# EAGLE design pcb_bottom (EAGLE 9.6.2)
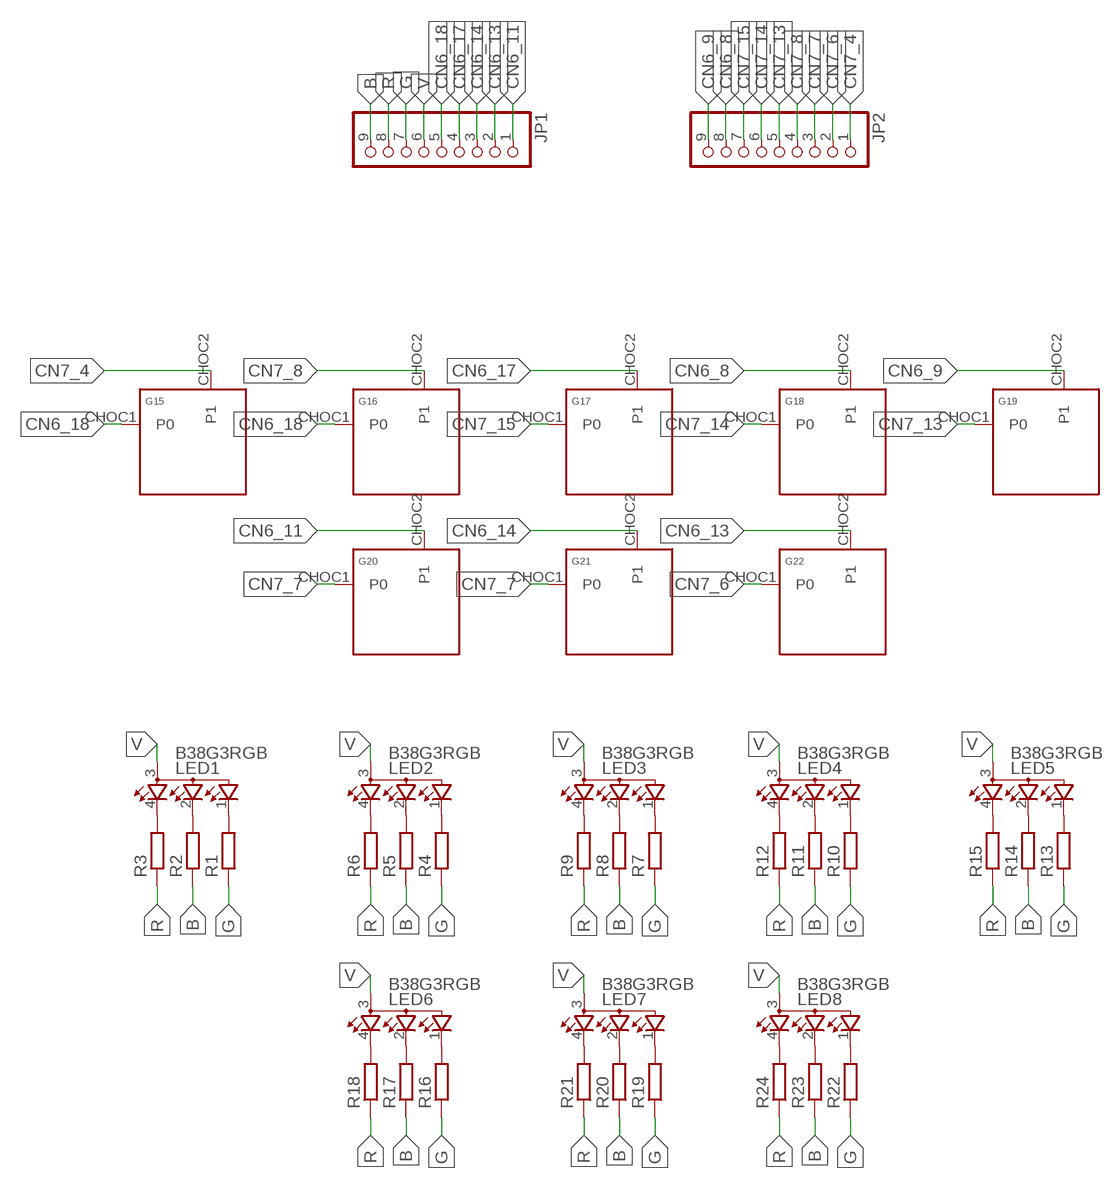
[diagram p0: schematic, sheet 1]

## Parts
G15  KEYSWITCH-PLAIN-CHOC-1U  [CHOC-1U]
G16  KEYSWITCH-PLAIN-CHOC-1U  [CHOC-1U]
G17  KEYSWITCH-PLAIN-CHOC-1U  [CHOC-1U]
G18  KEYSWITCH-PLAIN-CHOC-1U  [CHOC-1U]
G19  KEYSWITCH-PLAIN-CHOC-1U  [CHOC-1U]
G20  KEYSWITCH-PLAIN-CHOC-1U  [CHOC-1U]
G21  KEYSWITCH-PLAIN-CHOC-1U  [CHOC-1U]
G22  KEYSWITCH-PLAIN-CHOC-1U  [CHOC-1U]
JP1  THROUHOLE09  [THROUHOLE09]
JP2  THROUHOLE09  [THROUHOLE09]
LED1  B38G3RGB  [B38G3RGB]
LED2  B38G3RGB  [B38G3RGB]
LED3  B38G3RGB  [B38G3RGB]
LED4  B38G3RGB  [B38G3RGB]
LED5  B38G3RGB  [B38G3RGB]
LED6  B38G3RGB  [B38G3RGB]
LED7  B38G3RGB  [B38G3RGB]
LED8  B38G3RGB  [B38G3RGB]
R1  R-EU_R0603  [R0603]
R2  R-EU_R0603  [R0603]
R3  R-EU_R0603  [R0603]
R4  R-EU_R0603  [R0603]
R5  R-EU_R0603  [R0603]
R6  R-EU_R0603  [R0603]
R7  R-EU_R0603  [R0603]
R8  R-EU_R0603  [R0603]
R9  R-EU_R0603  [R0603]
R10  R-EU_R0603  [R0603]
R11  R-EU_R0603  [R0603]
R12  R-EU_R0603  [R0603]
R13  R-EU_R0603  [R0603]
R14  R-EU_R0603  [R0603]
R15  R-EU_R0603  [R0603]
R16  R-EU_R0603  [R0603]
R17  R-EU_R0603  [R0603]
R18  R-EU_R0603  [R0603]
R19  R-EU_R0603  [R0603]
R20  R-EU_R0603  [R0603]
R21  R-EU_R0603  [R0603]
R22  R-EU_R0603  [R0603]
R23  R-EU_R0603  [R0603]
R24  R-EU_R0603  [R0603]

## Nets
B: JP1.9 R2.1 R5.1 R8.1 R11.1 R14.1 R17.1 R20.1 R23.1
CN6_8: G18.CHOC2(P1) JP2.8
CN6_9: G19.CHOC2(P1) JP2.9
CN6_11: G20.CHOC2(P1) JP1.1
CN6_13: G22.CHOC2(P1) JP1.2
CN6_14: G21.CHOC2(P1) JP1.3
CN6_17: G17.CHOC2(P1) JP1.4
CN6_18: G15.CHOC1(P0) G16.CHOC1(P0) JP1.5
CN7_4: G15.CHOC2(P1) JP2.1
CN7_6: G22.CHOC1(P0) JP2.2
CN7_7: G20.CHOC1(P0) G21.CHOC1(P0) JP2.3
CN7_8: G16.CHOC2(P1) JP2.4
CN7_13: G19.CHOC1(P0) JP2.5
CN7_14: G18.CHOC1(P0) JP2.6
CN7_15: G17.CHOC1(P0) JP2.7
G: JP1.7 R1.1 R4.1 R7.1 R10.1 R13.1 R16.1 R19.1 R22.1
N$1: LED1.1(CGREEN) R1.2
N$2: LED1.2(CBLUE) R2.2
N$3: LED1.4(CRED) R3.2
N$4: LED2.1(CGREEN) R4.2
N$5: LED2.2(CBLUE) R5.2
N$6: LED2.4(CRED) R6.2
N$7: LED3.1(CGREEN) R7.2
N$8: LED3.2(CBLUE) R8.2
N$9: LED3.4(CRED) R9.2
N$10: LED4.1(CGREEN) R10.2
N$11: LED4.2(CBLUE) R11.2
N$12: LED4.4(CRED) R12.2
N$13: LED5.1(CGREEN) R13.2
N$14: LED5.2(CBLUE) R14.2
N$15: LED5.4(CRED) R15.2
N$16: LED6.1(CGREEN) R16.2
N$17: LED6.2(CBLUE) R17.2
N$18: LED6.4(CRED) R18.2
N$19: LED7.1(CGREEN) R19.2
N$20: LED7.2(CBLUE) R20.2
N$21: LED7.4(CRED) R21.2
N$22: LED8.1(CGREEN) R22.2
N$23: LED8.2(CBLUE) R23.2
N$24: LED8.4(CRED) R24.2
R: JP1.8 R3.1 R6.1 R9.1 R12.1 R15.1 R18.1 R21.1 R24.1
V: JP1.6 LED1.3(A) LED2.3(A) LED3.3(A) LED4.3(A) LED5.3(A) LED6.3(A) LED7.3(A) LED8.3(A)

## Library data of the parts
G15-G22 = Keyboard:KEYSWITCH-PLAIN
JP1 JP2 = pinhead-half-pitch:THROUHOLE09
LED1-LED8 = led_rgb:B38G3RGB: Chip LED RGB Source: http://document.sharpsma.com/files/GM1WA55311A_SS.pdf
R1-R24 = rcl:R-EU_: RESISTOR, European symbol; SPICEPREFIX: R

## Board
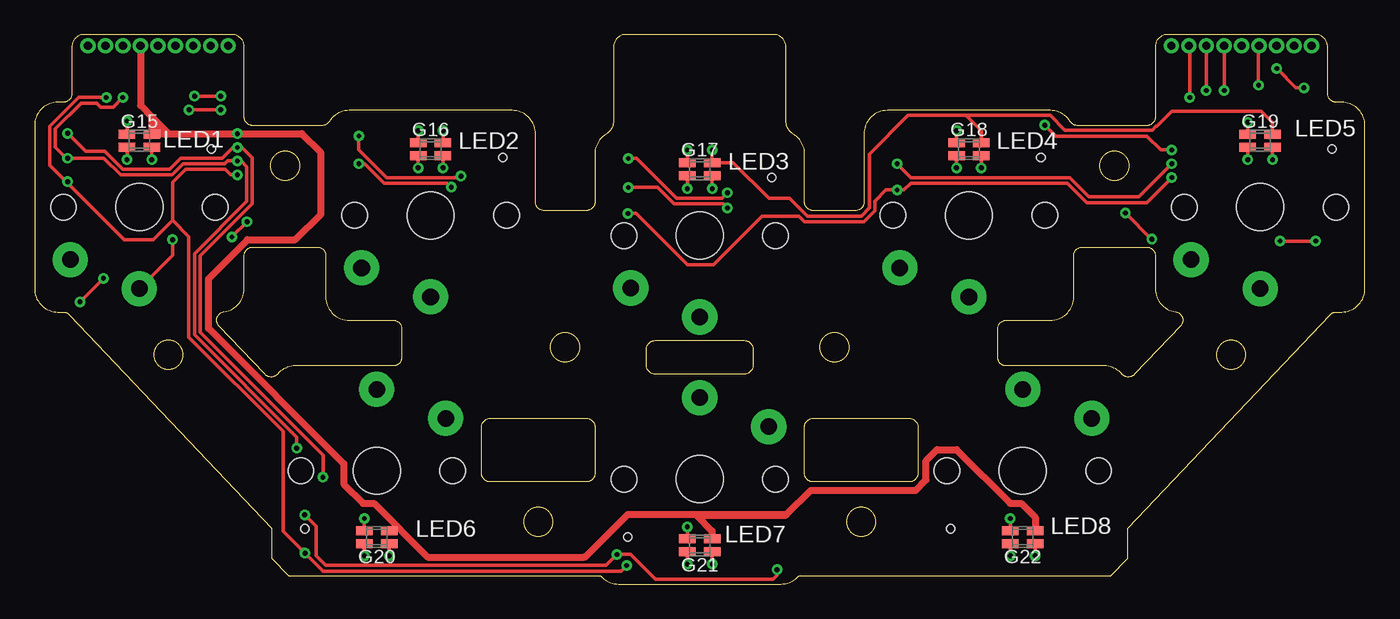
[diagram p1: board, top side]
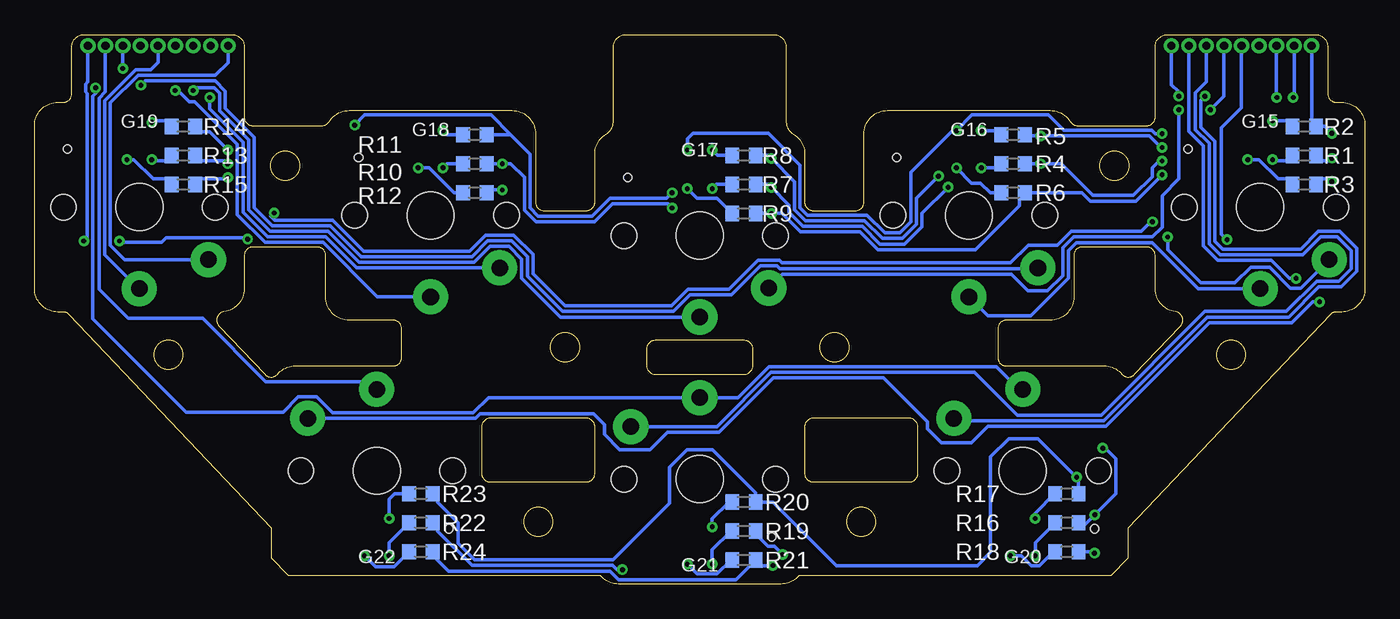
[diagram p2: board, bottom side, seen from below]

Size 96.4 x 39.8 mm. Coordinates in mm from the lower left corner, seen from the top.
Outline: 15.8,24.4 20.5,24.4 arc-90 21.1,23.8 21.1,20.8 arc90 22.8,19.1 26,19.1 arc-90 26.6,18.5 26.6,16.4 arc-90 26,15.8 18.9,15.8 arc50 17.6,15.2 arc-96 16.71,15.18 13.36,18.71 arc-126 13.72,19.71 arc83 15.2,21.4 15.2,23.8 arc-90 15.8,24.4
Outline: 75.3,20.8 75.3,23.8 arc-90 75.9,24.4 80.6,24.4 arc-90 81.2,23.8 81.2,21.4 arc83 82.68,19.71 arc-126 83.04,18.71 79.69,15.18 arc-96 78.8,15.2 arc50 77.5,15.8 70.4,15.8 arc-90 69.8,16.4 69.8,18.5 arc-90 70.4,19.1 73.6,19.1 arc90 75.3,20.8
Outline: 32.4,11.4 arc-90 33,12 40,12 arc-90 40.6,11.4 40.6,8 arc-90 40,7.4 33,7.4 arc-90 32.4,8 32.4,11.4
Outline: 55.8,11.4 arc-90 56.4,12 63.4,12 arc-90 64,11.4 64,8 arc-90 63.4,7.4 56.4,7.4 arc-90 55.8,8 55.8,11.4
Outline: 52.05,15.8 arc-90 51.45,15.2 44.95,15.2 arc-90 44.35,15.8 44.35,17.04 arc-90 44.95,17.64 51.45,17.64 arc-90 52.05,17.04 52.05,15.8
Outline: 80.6,33.2 75.56,33.2 arc-59 75.05,33.49 arc59 73.6,34.3 61.8,34.3 arc90 60.1,32.6 60.1,27.65 arc-90 59.5,27.05 56.4,27.05 arc-90 55.8,27.65 55.8,31.14 arc59 54.98,32.59 arc-59 54.45,33.53 54.45,38.9 arc90 53.55,39.8 42.85,39.8 arc90 41.95,38.9 41.95,33.53 arc-59 41.42,32.59 arc59 40.6,31.14 40.6,27.65 arc-90 40,27.05 36.9,27.05 arc-90 36.3,27.65 36.3,32.6 arc90 34.6,34.3 22.8,34.3 arc59 21.35,33.49 arc-59 20.84,33.2 15.8,33.2 arc-90 15.2,33.8 15.2,38.9 arc90 14.3,39.8 3.6,39.8 arc90 2.7,38.9 2.7,35.5 arc-90 2.1,34.9 1.7,34.9 arc90 0,33.2 0,21.4 arc90 1.7,19.7 2.1,19.7 arc-46 2.53,19.51 17.2,4.06 17.2,1.88 18.41,0.6 41,0.6 arc50 42.3,0 54.1,0 arc50 55.4,0.6 77.99,0.6 79.2,1.88 79.2,4.06 93.87,19.51 arc-46 94.3,19.7 94.7,19.7 arc90 96.4,21.4 96.4,33.2 arc90 94.7,34.9 94.3,34.9 arc-90 93.7,35.5 93.7,38.9 arc90 92.8,39.8 82.1,39.8 arc90 81.2,38.9 81.2,33.8 arc-90 80.6,33.2
Outline: circle at 18.15,30.3 radius 1.05
Outline: circle at 9.71,16.6 radius 1.05
Outline: circle at 36.5,4.5 radius 1.05
Outline: circle at 38.45,17.15 radius 1.05
Outline: circle at 57.95,17.15 radius 1.05
Outline: circle at 59.9,4.5 radius 1.05
Outline: circle at 86.69,16.6 radius 1.05
Outline: circle at 78.25,30.3 radius 1.05
Copper layers (1*16): Top 0.035mm / dielectric 1.5mm / Bottom 0.035mm
Design rules "PCBGoGo": minimum track width 6mil, minimum drill 0.2mm, track to track 6mil, track to pad 6mil, pad to pad 6mil, via to via 6mil, smd to smd 6mil, copper to edge 0.2mm, drill to drill 6mil, minimum pad ring 10mil, minimum via ring 8mil, stop-mask expansion 4mil, vias tented up to drill 0mil, thermal gap 10mil

### Footprints (pad centres in the part's own frame; a part is rotated, then mirrored left to right if it is on the bottom)
CHOC-1U = drill 1.2 pad 2.54: CHOC1 0,5.9; CHOC2 5,3.8 | hole 3.4: 0,0 | hole 0.6: -5.22,-4.2 | hole 1.85: -5.5,0; 5.5,0
THROUHOLE09 = drill 0.6: 1 -5.08,0; 2 -3.81,0; 3 -2.54,0; 4 -1.27,0; 5 0,0; 6 1.27,0; 7 2.54,0; 8 3.81,0; 9 5.08,0
B38G3RGB = smd 0.65 x 1.2: 1 -0.475,0.9; 2 0.475,0.9; 3 0.475,-0.9; 4 -0.475,-0.9
R0603 = smd 1 x 1.1: 1 -0.85,0; 2 0.85,0

### Placement (x,y rotation side)
G15  7.6,27.3 180 top
G16  28.7,26.7 180 top
G17  48.2,25.24 180 top
G18  67.7,26.7 180 top
G19  88.8,27.3 180 top
G20  24.8,8.2 0 top
G21  48.2,7.6 0 top
G22  71.6,8.2 0 top
JP1  8.95,38.99 180 top
JP2  87.45,38.99 180 top
LED1  7.6,32.1 90 top
LED2  28.7,31.5 90 top
LED3  48.2,30.04 90 top
LED4  67.7,31.5 90 top
LED5  88.8,32.1 90 top
LED6  24.8,3.4 90 top
LED7  48.2,2.8 90 top
LED8  71.6,3.4 90 top
R1  4.4,31.04 180 bottom
R2  4.4,33.14 180 bottom
R3  4.4,28.94 180 bottom
R4  25.5,30.44 180 bottom
R5  25.5,32.54 180 bottom
R6  25.5,28.34 180 bottom
R7  45,28.94 180 bottom
R8  45,31.04 180 bottom
R9  45,26.84 180 bottom
R10  64.5,30.44 180 bottom
R11  64.5,32.54 180 bottom
R12  64.5,28.34 180 bottom
R13  85.6,31.04 180 bottom
R14  85.6,33.14 180 bottom
R15  85.6,28.94 180 bottom
R16  21.6,4.44 180 bottom
R17  21.6,6.54 180 bottom
R18  21.6,2.34 180 bottom
R19  45,3.84 180 bottom
R20  45,5.94 180 bottom
R21  45,1.74 180 bottom
R22  68.4,4.44 180 bottom
R23  68.4,6.54 180 bottom
R24  68.4,2.34 180 bottom

### Tracks (layer width: path | path; a pad name or v marks a point on that pad's centre or on a via)
B  (via drill 0.35)
  Top 0.254: v2.4,32.64 3.7,31.34 5.1,31.34 6.4,30.04 9.8,30.04 10.6,30.84 13.6,30.84 14.38,31.62 v14.7,31.62 14.72,31.64 15,31.64 15.77,30.87 15.77,27.54 12,23.77 12,18.24 20.9,9.34 v20.9,7.74 | v23.5,32.45 23.5,31.44 25.5,29.44 30.8,29.44 v30.9,29.54 | v43.02,30.82 43.62,30.82 46.5,27.94 49.8,27.94 v50.2,28.34 | v82.4,31.44 81.6,31.44 80.6,32.44 74,32.44 v73.2,33.24
  Bottom 0.254: JP1.9 3.87,33.46 R2.1 2.9,33.14 v2.4,32.64 | v14.7,31.62 14.8,31.62 15.63,32.45 v23.5,32.45 24.57,32.45 R5.1 | v30.9,29.54 32.49,27.95 32.49,26.06 33.52,25.03 34.97,25.03 36.25,26.32 40.56,26.32 41.33,27.09 41.33,29.14 v43.02,30.82 43.23,31.04 R8.1 | v50.2,28.34 50.6,27.94 54.7,27.94 56,26.64 59.9,26.64 60.5,27.24 60.5,31.14 61.9,32.54 | 61.9,32.54 R11.1 | R14.1 84.35,32.74 83.7,32.74 v82.4,31.44 | v73.2,33.24 72.47,33.97 63.33,33.97 61.9,32.54 | R17.1 20.75,7.59 v20.9,7.74 23.7,10.54 25.8,10.54 27.13,9.21 27.13,2.3 28.09,1.34 38.3,1.34 42.9,5.94 R20.1 44.15,6.62 47.26,9.73 49.14,9.73 50.4,8.47 50.4,5.85 54.5,1.75 64.51,1.75 65.7,2.94 65.7,4.44 67.2,5.94 67.2,6.19 R23.1
CN6_8  (via drill 0.35)
  Top 0.254: v83.7,35.24 83.7,38.93 JP2.8
  Bottom 0.254: G18.CHOC2 73.06,22.9 75.31,25.15 79.51,25.15 81.29,26.93 81.29,32.01 83.7,34.41 v83.7,35.24
CN6_9
  Bottom 0.254: G19.CHOC2 89.85,23.5 90.9,24.55 90.9,34.84 88.9,36.84 83.3,36.84 82.37,37.77 JP2.9
CN6_11  (via drill 0.35)
  Top 0.254: v11.6,35.34 v13.5,35.34
  Bottom 0.254: G20.CHOC2 29.63,11.83 18.93,11.83 11.43,19.33 5.53,19.33 3.33,21.53 1.73,21.53 0.59,22.67 0.59,24.31 1.83,25.55 3.37,25.55 4.67,24.25 10.31,24.25 10.89,24.82 10.89,32.08 11.88,33.07 11.88,35.06 v11.6,35.34 | v13.5,35.34 13.5,35.64 14.03,36.17 JP1.1
CN6_13  (via drill 0.35)
  Top 0.254: v5,22.14 v3.3,20.44
  Bottom 0.254: G22.CHOC2 64.44,12 64.1,12.34 55.9,12.34 55.1,11.54 55.1,10.84 54,9.74 51.8,9.74 50.55,10.99 46.8,10.99 42.86,14.93 34.89,14.93 31.7,11.74 31.7,11.24 30.7,10.24 28.5,10.24 27.31,11.43 18.76,11.43 11.26,18.93 5.31,18.93 3.8,20.44 v3.3,20.44 | v5,22.14 5.5,22.14 6.79,23.43 10.65,23.43 11.7,24.48 11.7,31.74 12.76,32.8 JP1.2
CN6_14
  Bottom 0.254: G21.CHOC2 46.97,11.4 43.03,15.33 28.29,15.33 25.2,12.24 19.1,12.24 11.6,19.74 5.7,19.74 3.5,21.94 1.9,21.94 1,22.84 1,24.14 2,25.14 3.2,25.14 4.5,23.84 10.48,23.84 11.29,24.65 11.29,31.91 12.29,32.91 12.29,35.59 11.49,36.39 JP1.3
CN6_17  (via drill 0.35)
  Top 0.254: v13.5,34.34 v11.2,34.34
  Bottom 0.254: v13.5,34.34 13.5,29.34 14.7,28.14 14.7,25.84 15.4,25.14 21.1,25.14 21.9,24.34 21.9,22.34 23,21.24 24.43,21.24 25.63,22.43 42.21,22.43 G17.CHOC2 | v11.2,34.34 10.22,35.32 JP1.4
CN6_18  (via drill 0.35)
  Top 0.254: v10,24.94 10,23.8 G15.CHOC1
  Bottom 0.254: G15.CHOC1 12.06,21.4 15.39,24.73 20.91,24.73 21.49,24.15 21.49,22.13 24.2,19.43 27.33,19.43 G16.CHOC1 | JP1.5 8.95,34.49 10.4,33.04 10.4,25.34 v10,24.94
CN7_4  (via drill 0.35)
  Top 0.254: v15.4,26.24 v14.3,25.14 | v80.96,24.98 80.93,24.98 v79.04,26.88 | v90.24,24.84 v92.83,24.84
  Bottom 0.254: G15.CHOC2 4.66,21.44 5.4,21.44 6.91,22.95 8.29,22.95 9.43,21.81 11.89,21.81 14.3,24.21 v14.3,25.14 | v15.4,26.24 15.5,26.24 16.19,25.55 21.27,25.55 22.28,24.54 24.4,24.54 25.69,23.25 42.24,23.25 42.43,23.45 43.97,23.45 46.07,21.35 49.07,21.35 50.26,20.15 57.96,20.15 60.29,22.48 60.29,23.88 61.67,25.26 63.73,25.26 64.87,24.12 72.56,24.12 74.8,26.37 79,26.37 79.27,26.64 v79.04,26.88 | v80.96,24.98 81.06,25.08 86.86,25.08 87.2,24.74 90.14,24.74 v90.24,24.84 | v92.83,24.84 92.58,25.09 92.58,35.52 92.7,35.64 92.7,36.22 92.53,36.39 JP2.1
CN7_6
  Bottom 0.254: G22.CHOC1 72.16,14.66 79.64,14.66 84.22,19.24 89.6,19.24 91.71,21.35 91.71,35.2 91.26,35.66 JP2.2
CN7_7  (via drill 0.35)
  Top 0.254: v91.97,35.94 91.4,35.94 v90,37.34
  Bottom 0.254: G20.CHOC1 25.06,14.1 26.7,15.74 43.2,15.74 45.44,13.5 G21.CHOC1 63.52,13.5 64.61,12.41 74.81,12.41 75.96,13.55 77.29,13.55 78.4,12.44 85.4,12.44 92.17,19.21 92.17,35.34 91.97,35.54 v91.97,35.94 | v90,37.34 90,38.98 JP2.3
CN7_8  (via drill 0.35)
  Top 0.254: v88.69,36.12 88.69,38.95 JP2.4
  Bottom 0.254: v88.69,36.12 88.38,36.43 83.32,36.43 82.59,35.71 82.59,34.46 80.48,32.34 80.48,27.27 79.17,25.96 74.97,25.96 72.72,23.71 64.7,23.71 63.56,24.86 61.84,24.86 60.69,23.71 60.69,22.31 58.13,19.75 50.09,19.75 48.9,20.94 45.9,20.94 43.8,23.04 42.6,23.04 42.4,22.84 23.76,22.84 G16.CHOC2
CN7_13
  Bottom 0.254: JP2.5 87.45,37.79 87.99,37.25 89.07,37.25 91.31,35.01 91.31,23.85 88.86,21.4 G19.CHOC1
CN7_14  (via drill 0.35)
  Top 0.254: v86.2,35.74 86.2,38.97 JP2.6
  Bottom 0.254: G18.CHOC1 71.56,20.8 75.5,24.74 79.7,24.74 81.7,26.74 81.7,31.84 84.8,34.94 85.2,34.94 86,35.74 v86.2,35.74
CN7_15  (via drill 0.35)
  Top 0.254: v84.9,35.74 84.9,38.98 JP2.7
  Bottom 0.254: G17.CHOC1 58.3,19.34 61.1,22.14 61.1,23.54 62.01,24.45 63.39,24.45 64.53,23.31 72.89,23.31 75.14,25.55 79.34,25.55 80.89,27.1 80.89,32.18 83,34.29 83,35.54 83.4,35.94 84.7,35.94 v84.9,35.74
G  (via drill 0.35)
  Top 0.254: v6.4,35.24 5.7,34.54 4.8,34.54 4.51,34.83 3.37,34.83 1.51,32.97 1.51,31.63 2.3,30.84 v2.4,30.84 5.03,30.84 6.23,29.63 9.97,29.63 10.77,30.43 13.79,30.43 14,30.64 v14.7,30.64 14.97,30.64 15.37,30.24 15.37,27.71 11.59,23.94 11.59,18.05 19,10.64 v19,9.84 | v30.2,28.74 29.91,29.03 25.33,29.03 23.91,30.45 23.51,30.45 v23.5,30.44 | v43.02,28.72 45.15,28.72 46.33,27.53 49.91,27.53 v50.2,27.24 | v82.4,30.44 80,28.04 76.4,28.04 75,29.44 63.5,29.44 v62.5,30.44 | v19.58,5.01 20.4,4.19 20.4,2.04 21.09,1.35 41.41,1.35 v42.2,2.14 43.2,2.14 45,0.34 53.5,0.34 53.8,0.64 v53.8,1.04
  Bottom 0.254: JP1.7 v6.41,35.25 v6.4,35.24 | v2.4,30.84 2.6,30.64 3.15,30.64 R1.1 | v14.7,30.64 14.9,30.64 15.4,30.14 15.4,29.52 16.77,28.15 19.71,28.15 22,30.44 v23.5,30.44 R4.1 | v30.2,28.74 32.09,26.85 32.09,25.89 33.35,24.63 35.14,24.63 36.42,25.91 40.73,25.91 41.74,26.92 41.74,27.44 v43.02,28.72 43.24,28.94 R7.1 | v50.2,27.24 50.49,27.53 54.53,27.53 55.83,26.23 60.07,26.23 60.91,27.07 60.91,29.45 61.9,30.44 v62.5,30.44 R10.1 | R13.1 84.7,31.04 84.3,30.64 82.6,30.64 v82.4,30.44 | v19,9.84 18.8,9.84 18.05,9.09 18.05,6.54 v19.58,5.01 20.35,4.24 20.55,4.24 R16.1 | R19.1 44.15,3.64 43.25,2.74 42.8,2.74 v42.2,2.14 | R22.1 67.2,4.09 67.2,3.84 64.71,1.35 54.51,1.35 54.2,1.04 v53.8,1.04
N$1  (via drill 0.35)
  Top 0.254: v6.7,30.74 LED1.1
  Bottom 0.254: R1.2 5.65,30.64 6.6,30.64 v6.7,30.74
N$2  (via drill 0.35)
  Top 0.254: v6.7,33.54 LED1.2
  Bottom 0.254: R2.2 5.65,33.54 v6.7,33.54
N$3  (via drill 0.35)
  Top 0.254: v8.5,30.74 LED1.4
  Bottom 0.254: v8.5,30.74 7.7,30.74 6.3,29.34 5.65,29.34 R3.2
N$4  (via drill 0.35)
  Top 0.254: v27.8,30.14 LED2.1
  Bottom 0.254: R4.2 26.5,30.44 26.8,30.14 v27.8,30.14
N$5  (via drill 0.35)
  Top 0.254: v27.8,32.84 LED2.2
  Bottom 0.254: R5.2 26.5,32.54 26.8,32.84 v27.8,32.84
N$6  (via drill 0.35)
  Top 0.254: v29.6,30.14 LED2.4
  Bottom 0.254: R6.2 27.15,28.34 27.85,29.04 28.5,29.04 v29.6,30.14
N$7  (via drill 0.35)
  Top 0.254: v47.3,28.64 LED3.1
  Bottom 0.254: R7.2 47,28.94 v47.3,28.64
N$8  (via drill 0.35)
  Top 0.254: v47.3,31.44 LED3.2
  Bottom 0.254: R8.2 46.9,31.04 v47.3,31.44
N$9  (via drill 0.35)
  Top 0.254: v49.1,28.64 LED3.4
  Bottom 0.254: R9.2 46.95,27.94 48.4,27.94 v49.1,28.64
N$10  (via drill 0.35)
  Top 0.254: v66.8,30.14 LED4.1
  Bottom 0.254: R10.2 66.5,30.44 v66.8,30.14
N$11  (via drill 0.35)
  Top 0.254: v66.8,32.84 LED4.2
  Bottom 0.254: R11.2 66.5,32.54 v66.8,32.84
N$12  (via drill 0.35)
  Top 0.254: LED4.4 v68.6,30.14
  Bottom 0.254: v68.6,30.14 67.8,30.14 66,28.34 R12.2
N$13  (via drill 0.35)
  Top 0.254: LED5.1 v87.9,30.74
  Bottom 0.254: v87.9,30.74 87.8,30.64 86.85,30.64 R13.2
N$14  (via drill 0.35)
  Top 0.254: v87.9,33.44 LED5.2
  Bottom 0.254: R14.2 86.85,33.54 87.8,33.54 v87.9,33.44
N$15  (via drill 0.35)
  Top 0.254: LED5.4 v89.7,30.74
  Bottom 0.254: R15.2 86.85,29.34 87.8,29.34 89.2,30.74 v89.7,30.74
N$16  (via drill 0.35)
  Top 0.254: v23.9,2.04 LED6.1
  Bottom 0.254: R16.2 23.9,2.99 v23.9,2.04
N$17  (via drill 0.35)
  Top 0.254: LED6.2 v23.9,4.74
  Bottom 0.254: v23.9,4.74 23.9,5.14 22.5,6.54 R17.2
N$18  (via drill 0.35)
  Top 0.254: v25.7,2.04 LED6.4
  Bottom 0.254: R18.2 22.59,2.34 23.6,1.33 24.19,1.33 24.9,2.04 v25.7,2.04
N$19  (via drill 0.35)
  Top 0.254: v47.3,1.44 LED7.1
  Bottom 0.254: R19.2 45.95,3.84 47.3,2.49 v47.3,1.44
N$20  (via drill 0.35)
  Top 0.254: LED7.2 v47.3,4.14
  Bottom 0.254: v47.3,4.14 47.3,4.73 46.09,5.94 R20.2
N$21  (via drill 0.35)
  Top 0.254: v49.1,1.44 LED7.4
  Bottom 0.254: R21.2 45.95,1.74 46.95,0.74 48.4,0.74 v49.1,1.44
N$22  (via drill 0.35)
  Top 0.254: v70.7,2.04 LED8.1
  Bottom 0.254: R22.2 70.7,2.99 v70.7,2.04
N$23  (via drill 0.35)
  Top 0.254: v70.7,4.74 LED8.2
  Bottom 0.254: R23.2 70.3,6.54 70.7,6.14 v70.7,4.74
N$24  (via drill 0.35)
  Top 0.254: v72.5,2.04 LED8.4
  Bottom 0.254: R24.2 70.35,1.24 71.7,1.24 v72.5,2.04
R  (via drill 0.35)
  Top 0.254: v5.2,35.24 3.2,35.24 1.1,33.14 1.1,30.34 2.3,29.14 v2.4,29.14 2.4,29.04 6.5,24.94 8.6,24.94 10,26.34 | 10,26.34 10,29.09 10.94,30.03 13.81,30.03 14.2,29.64 v14.7,29.64 | v43,26.84 43.6,26.84 47.3,23.14 49.2,23.14 52.7,26.64 55.4,26.64 55.8,26.24 60.1,26.24 60.9,27.04 60.9,27.74 61.7,28.54 v62.5,28.54 63,28.54 63.49,29.03 74.83,29.03 76.24,27.63 80.59,27.63 v82.4,29.44 | 10,26.34 11.19,25.15 11.19,17.88 18,11.06 18,3.84 v19.6,2.24 20.9,0.94 42.5,0.94 v42.9,1.34
  Bottom 0.254: JP1.8 5.14,35.3 v5.2,35.24 | R3.1 3.15,29.34 2.6,29.34 v2.4,29.14 | v14.7,29.64 16.6,27.74 19.9,27.74 20.5,28.34 R6.1 25.05,27.94 25.05,27.39 28.22,24.22 35.31,24.22 36.59,25.5 40.89,25.5 42.23,26.84 v43,26.84 R9.1 | v62.5,28.54 63.45,28.54 R12.1 | R15.1 84.65,28.94 84.25,29.34 82.5,29.34 v82.4,29.44 | v19.6,2.24 19.7,2.34 R18.1 | v42.9,1.34 43.75,1.34 R21.1 45.56,0.33 54.09,0.33 54.7,0.94 66.4,0.94 67.55,2.09 R24.1
V  (via drill 0.35)
  Top 0.254: v29.6,32.84 LED2.3 | v49.1,31.44 LED3.3 50.62,30.52 53.2,27.94 54.7,27.94 55.99,26.65 59.9,26.65 60.49,27.24 60.49,27.91 60.5,27.91 60.5,31.14 63.3,33.94 67.5,33.94 | 67.5,33.94 68.6,32.84 LED4.3 | LED5.3 89.7,33.44 88.9,34.24 82.4,34.24 81.3,33.14 81.26,33.14 80.99,32.87 74.67,32.87 73.6,33.94 67.5,33.94 | 26.2,4.24 24.6,5.84 | 26.2,4.24 28.49,1.95 | LED6.3 25.7,3.94 25.9,3.94 26.2,4.24 | 12.61,18.64 12.61,18.51 | 39.8,1.95 39.9,1.95
  Top 0.508: JP1.6 7.68,34.66 8.5,33.84 | 8.5,33.84 8.5,33.24 | 8.5,33.24 8.5,32.94 | 8.5,32.94 LED1.3 8.55,32.62 9.2,32.62 | 9.2,32.62 9.72,32.62 | 9.72,32.62 v14.7,32.62 19.36,32.62 20.76,31.22 20.76,26.79 18.9,24.94 15.44,24.94 12.61,22.1 12.61,18.64 | 12.61,18.51 22.4,8.71 22.4,7.24 23.8,5.84 24.6,5.84 28.49,1.95 39.8,1.95 | 39.9,1.95 42.99,5.04 47.9,5.04 | 47.9,5.04 47.95,4.99 | 47.95,4.99 49.1,3.84 LED7.3 | 47.95,4.99 54.45,4.99 54.5,5.04 | 54.5,5.04 56.25,6.79 63.85,6.79 64.6,7.54 64.6,8.94 65.4,9.74 66.8,9.74 70.7,5.84 71.5,5.84 72.5,4.84 LED8.3 | 47.9,5.04 54.5,5.04 | 8.5,33.84 9.72,32.62 | 9.2,32.62 8.88,32.94 | 8.5,32.94 8.88,32.94 | 8.88,32.94 8.58,33.24 8.5,33.24
  Bottom 0.254: v14.7,32.62 15.18,32.62 15.43,32.87 21.83,32.87 22.93,33.97 28.47,33.97 v29.6,32.84 29.9,32.84 32.9,29.84 32.9,26.23 33.69,25.44 34.8,25.44 36.08,26.72 40.39,26.72 40.93,27.26 40.93,30.34 43.23,32.64 48.7,32.64 49.1,32.24 v49.1,31.44